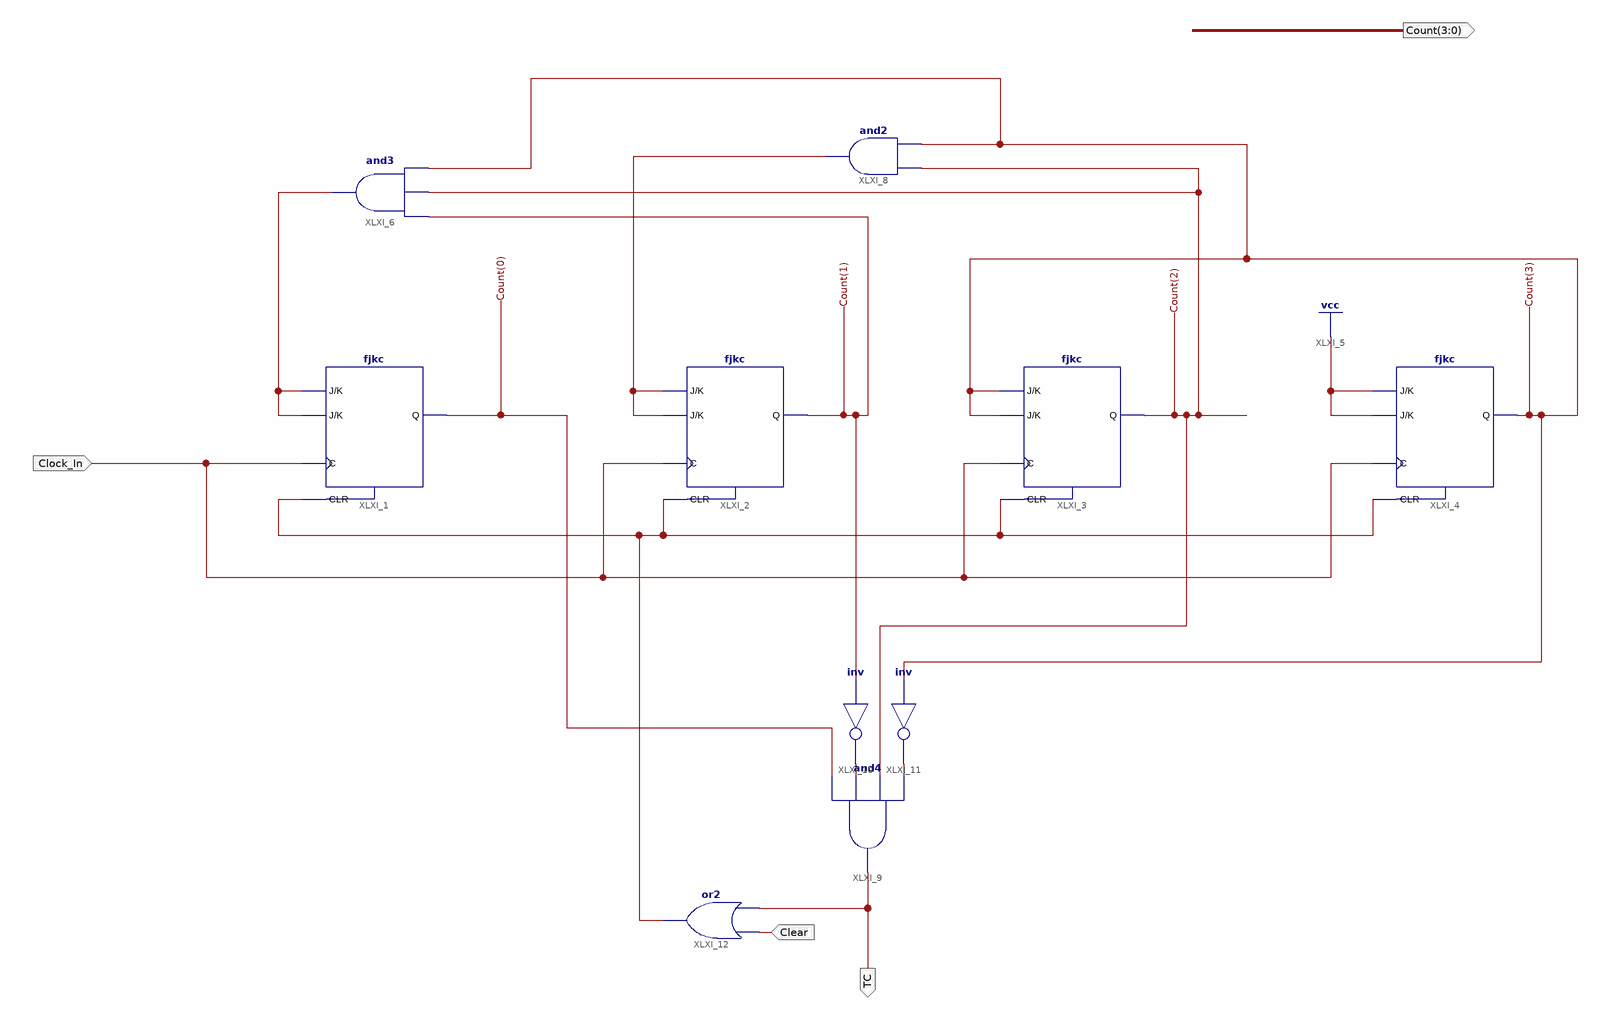
[diagram p0: schematic sheet 1]
// Xilinx ISE schematic Counter0_9.sch (spartan6) as structural Verilog: 10 symbols, 4 ports
module Counter0_9 (
  input  Clock_In,
  input  Clear,
  output TC,
  output [3:0] Count
);

  wire XLXN_6, XLXN_9, XLXN_14, XLXN_18, XLXN_19;

  fjkc XLXI_1 (.C(Clock_In), .CLR(XLXN_14), .J(XLXN_6), .K(XLXN_6), .Q(Count[0]));
  fjkc XLXI_2 (.C(Clock_In), .CLR(XLXN_14), .J(XLXN_9), .K(XLXN_9), .Q(Count[1]));
  fjkc XLXI_3 (.C(Clock_In), .CLR(XLXN_14), .J(Count[3]), .K(Count[3]), .Q(Count[2]));
  fjkc XLXI_4 (.C(Clock_In), .CLR(XLXN_14), .J(1'b1), .K(1'b1), .Q(Count[3]));
  and XLXI_6 (XLXN_6, Count[1], Count[2], Count[3]);
  and XLXI_8 (XLXN_9, Count[2], Count[3]);
  and XLXI_9 (TC, Count[0], XLXN_18, Count[2], XLXN_19);
  not XLXI_10 (XLXN_18, Count[1]);
  not XLXI_11 (XLXN_19, Count[3]);
  or XLXI_12 (XLXN_14, Clear, TC);
endmodule
